# EAGLE board wb_imx233_core_rev_c3 (EAGLE 6.4)
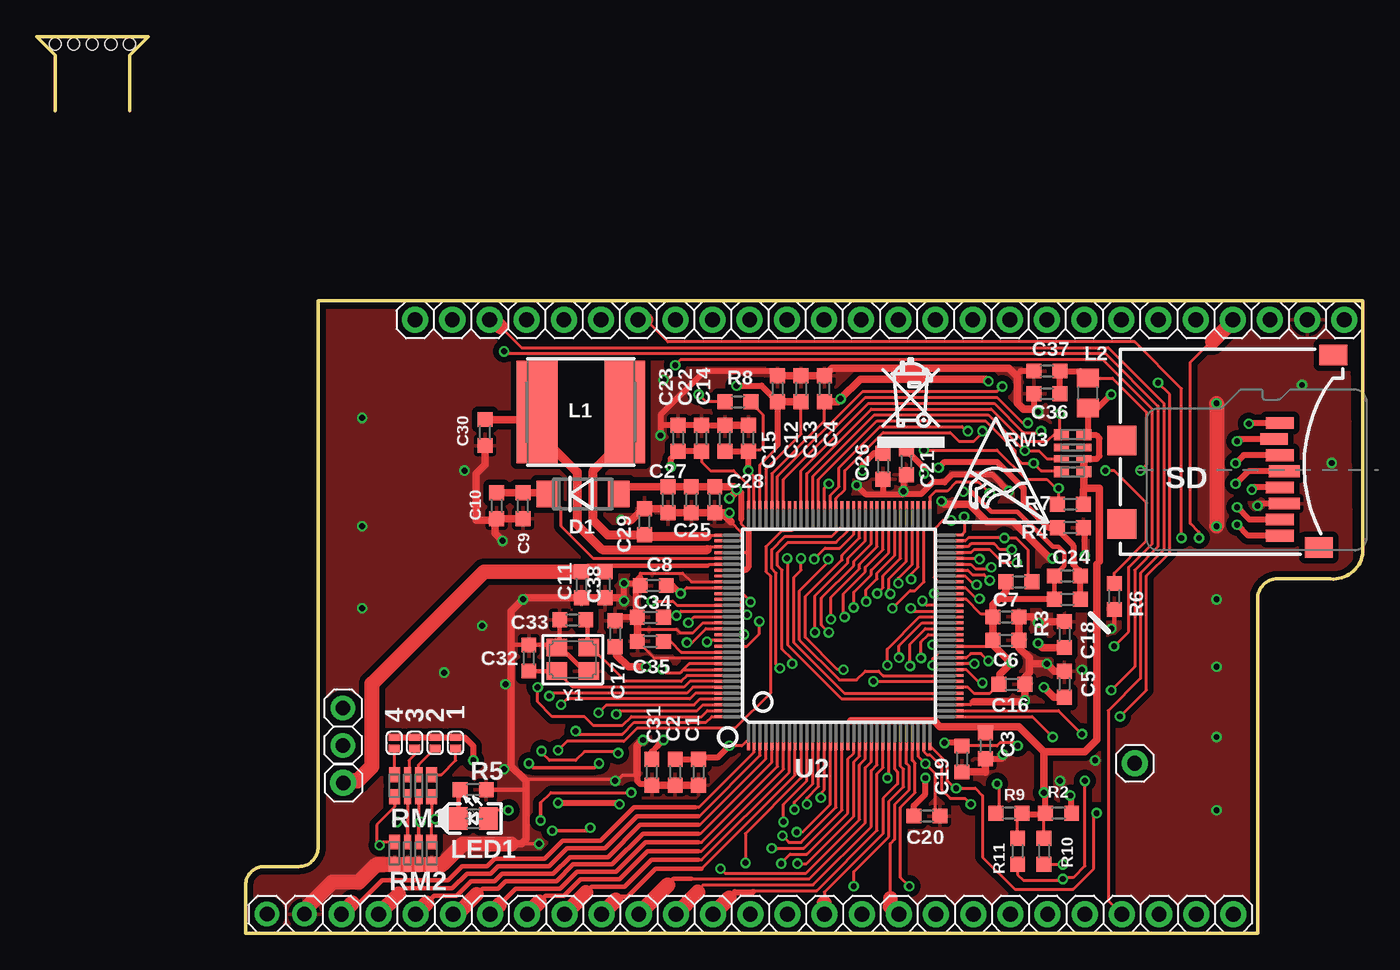
[diagram p2: board, top side]
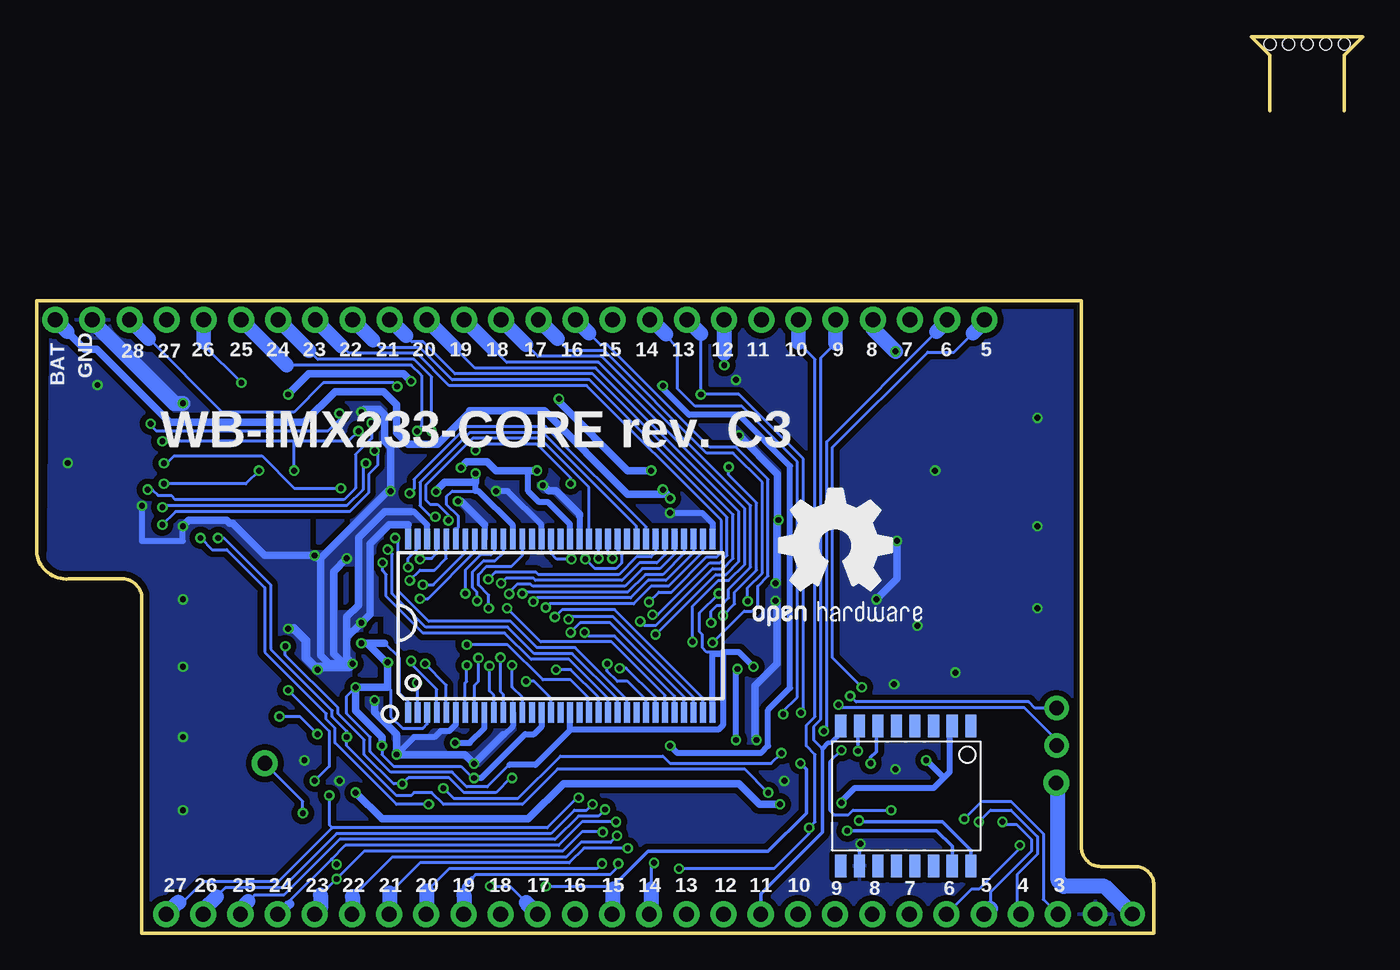
[diagram p3: board, bottom side, seen from below]

Size 90.64 x 61.25 mm. Coordinates in mm from the lower left corner, seen from the top.
Outline: 6.35,56.17 6.35,59.98 7.62,61.25 0,61.25 1.27,59.98 1.27,56.17
Outline: 14.29,0 83.44,0 83.44,23 arc-74 84.64,24.2 88.44,24.2 arc90 90.64,26.06 90.64,43.2 19.24,43.2 19.24,5.87 arc-90 17.92,4.55 15.56,4.55 arc90 14.29,3.28 14.29,0
Copper layers (1*16): Top 0.035mm / dielectric 1.5mm / Bottom 0.035mm
Design rules "SeeedStudio_DRU_no_angle_2layer_Yakov *": minimum track width 6mil, minimum drill 12mil, track to track 0.2mm, track to pad 6mil, pad to pad 6mil, via to via 6mil, smd to smd 0mil, copper to edge 10mil, drill to drill 10mil, minimum pad ring 2mil, minimum via ring 6mil, stop-mask expansion 1mil, vias tented up to drill 25mil, thermal gap 10mil
Net classes: 1 PWR: width 0.203 mm, drill 0.4 mm, clearance 0.076 mm
Holes 0.8 mm at 1.27,60.74 2.54,60.74 3.81,60.74 5.08,60.74 6.35,60.74
tRestrict: 1 lines

## Footprints (pad centres in the part's own frame; a part is rotated, then mirrored left to right if it is on the bottom)
C0603_DWS = smd 1.016 x 1.016: 1 -0.889,0; 2 0.889,0
MLL-41 = smd 1.45 x 1.8: A 2.445,0; K -2.445,0
SJ_1_SMALLER = smd 0.508 x 0.762: 1 -0.381,0; 2 0.381,0
1X02-R = drill 1 pad 1.676: 1 -1.27,0; 2 1.27,0
1X01 = drill 1.016 pad 1.778: 1 0,0
1X25 = drill 1.016 pad 1.778: 1 -29.21,0; 2 -26.67,0; 3 -24.13,0; 4 -21.59,0; 5 -19.05,0; 6 -16.51,0; 7 -13.97,0; 8 -11.43,0; 9 -8.89,0; 10 -6.35,0; 11 -3.81,0; 12 -1.27,0; 13 1.27,0; 14 3.81,0; 15 6.35,0; 16 8.89,0; 17 11.43,0; 18 13.97,0; 19 16.51,0; 20 19.05,0; 21 21.59,0; 22 24.13,0; 23 26.67,0; 24 29.21,0; 25 31.75,0
L7078 = smd 2.8 x 7: 1 -3,0; 2 3,0
L0805_5MIL_DWS = smd 1.27 x 1.524: 1 -1.016,0; 2 1.016,0
LED-0805 = smd 1.27 x 1.524: A 1.016,0; C -1.016,0
R0603_5MIL_DWS = smd 1.016 x 1.016: 1 -0.889,0; 2 0.889,0
R_MATRIX_4 = smd 1.016 x 0.762: 1.1 -0.762,1.27; 1.2 0.762,1.27; 4.1 -0.762,-1.27; 4.2 0.762,-1.27 | smd 1.016 x 0.508: 2.1 -0.762,0.381; 2.2 0.762,0.381; 3.1 -0.762,-0.381; 3.2 0.762,-0.381
TFR/C-MEM-CON = smd 0.8 x 1.9: 1 -3.2,10.9; 2 -2.1,10.5; 3 -1,10.9; 5 1.2,10.9; 7 3.4,10.9; 8 4.5,10.9 | smd 0.8 x 2.1: 4 0.1,11.2; 6 2.3,11.2 | smd 2 x 2: 9 3.7,0.1; 10 -2,0.1 | smd 1.4 x 1.9: 11 5.3,13.55; 12 -7.85,14.55
66TSOP-II = smd 0.4 x 1.4: 1 -10.4,-5.925; 2 -9.75,-5.925; 3 -9.1,-5.925; 4 -8.45,-5.925; 5 -7.8,-5.925; 6 -7.15,-5.925; 7 -6.5,-5.925; 8 -5.85,-5.925; 9 -5.2,-5.925; 10 -4.55,-5.925; 11 -3.9,-5.925; 12 -3.25,-5.925; 13 -2.6,-5.925; 14 -1.95,-5.925; 15 -1.3,-5.925; 16 -0.65,-5.925; 17 0,-5.925; 18 0.65,-5.925; 19 1.3,-5.925; 20 1.95,-5.925; 21 2.6,-5.925; 22 3.25,-5.925; 23 3.9,-5.925; 24 4.55,-5.925; 25 5.2,-5.925; 26 5.85,-5.925; 27 6.5,-5.925; 28 7.15,-5.925; 29 7.8,-5.925; 30 8.45,-5.925; 31 9.1,-5.925; 32 9.75,-5.925; 33 10.4,-5.925; 34 10.4,5.925; 35 9.75,5.925; 36 9.1,5.925; 37 8.45,5.925; 38 7.8,5.925; 39 7.15,5.925; 40 6.5,5.925; 41 5.85,5.925; 42 5.2,5.925; 43 4.55,5.925; 44 3.9,5.925; 45 3.25,5.925; 46 2.6,5.925; 47 1.95,5.925; 48 1.3,5.925; 49 0.65,5.925; 50 0,5.925; 51 -0.65,5.925; 52 -1.3,5.925; 53 -1.95,5.925; 54 -2.6,5.925; 55 -3.25,5.925; 56 -3.9,5.925; 57 -4.55,5.925; 58 -5.2,5.925; 59 -5.85,5.925; 60 -6.5,5.925; 61 -7.15,5.925; 62 -7.8,5.925; 63 -8.45,5.925; 64 -9.1,5.925; 65 -9.75,5.925; 66 -10.4,5.925
TQFP128LD = smd 0.2 x 1.5: 1 -6.2,-7.75; 2 -5.8,-7.75; 3 -5.4,-7.75; 4 -5,-7.75; 5 -4.6,-7.75; 6 -4.2,-7.75; 7 -3.8,-7.75; 8 -3.4,-7.75; 9 -3,-7.75; 10 -2.6,-7.75; 11 -2.2,-7.75; 12 -1.8,-7.75; 13 -1.4,-7.75; 14 -1,-7.75; 15 -0.6,-7.75; 16 -0.2,-7.75; 17 0.2,-7.75; 18 0.6,-7.75; 19 1,-7.75; 20 1.4,-7.75; 21 1.8,-7.75; 22 2.2,-7.75; 23 2.6,-7.75; 24 3,-7.75; 25 3.4,-7.75; 26 3.8,-7.75; 27 4.2,-7.75; 28 4.6,-7.75; 29 5,-7.75; 30 5.4,-7.75; 31 5.8,-7.75; 32 6.2,-7.75; 65 6.2,7.75; 66 5.8,7.75; 67 5.4,7.75; 68 5,7.75; 69 4.6,7.75; 70 4.2,7.75; 71 3.8,7.75; 72 3.4,7.75; 73 3,7.75; 74 2.6,7.75; 75 2.2,7.75; 76 1.8,7.75; 77 1.4,7.75; 78 1,7.75; 79 0.6,7.75; 80 0.2,7.75; 81 -0.2,7.75; 82 -0.6,7.75; 83 -1,7.75; 84 -1.4,7.75; 85 -1.8,7.75; 86 -2.2,7.75; 87 -2.6,7.75; 88 -3,7.75; 89 -3.4,7.75; 90 -3.8,7.75; 91 -4.2,7.75; 92 -4.6,7.75; 93 -5,7.75; 94 -5.4,7.75; 95 -5.8,7.75; 96 -6.2,7.75 | smd 1.5 x 0.2: 33 7.75,-6.2; 34 7.75,-5.8; 35 7.75,-5.4; 36 7.75,-5; 37 7.75,-4.6; 38 7.75,-4.2; 39 7.75,-3.8; 40 7.75,-3.4; 41 7.75,-3; 42 7.75,-2.6; 43 7.75,-2.2; 44 7.75,-1.8; 45 7.75,-1.4; 46 7.75,-1; 47 7.75,-0.6; 48 7.75,-0.2; 49 7.75,0.2; 50 7.75,0.6; 51 7.75,1; 52 7.75,1.4; 53 7.75,1.8; 54 7.75,2.2; 55 7.75,2.6; 56 7.75,3; 57 7.75,3.4; 58 7.75,3.8; 59 7.75,4.2; 60 7.75,4.6; 61 7.75,5; 62 7.75,5.4; 63 7.75,5.8; 64 7.75,6.2; 97 -7.75,6.2; 98 -7.75,5.8; 99 -7.75,5.4; 100 -7.75,5; 101 -7.75,4.6; 102 -7.75,4.2; 103 -7.75,3.8; 104 -7.75,3.4; 105 -7.75,3; 106 -7.75,2.6; 107 -7.75,2.2; 108 -7.75,1.8; 109 -7.75,1.4; 110 -7.75,1; 111 -7.75,0.6; 112 -7.75,0.2; 113 -7.75,-0.2; 114 -7.75,-0.6; 115 -7.75,-1; 116 -7.75,-1.4; 117 -7.75,-1.8; 118 -7.75,-2.2; 119 -7.75,-2.6; 120 -7.75,-3; 121 -7.75,-3.4; 122 -7.75,-3.8; 123 -7.75,-4.2; 124 -7.75,-4.6; 125 -7.75,-5; 126 -7.75,-5.4; 127 -7.75,-5.8; 128 -7.75,-6.2
1 = smd 0.762 x 1.524: 1 -4.445,-4.775; 2 -3.175,-4.775; 3 -1.905,-4.775; 4 -0.635,-4.775; 5 0.635,-4.775; 6 1.905,-4.775; 7 3.175,-4.775; 8 4.445,-4.775; 9 4.445,4.775; 10 3.175,4.775; 11 1.905,4.775; 12 0.635,4.775; 13 -0.635,4.775; 14 -1.905,4.775; 15 -3.175,4.775; 16 -4.445,4.775
CRYSTAL_3.2X2.5 = smd 1.4 x 1.2: 1 -1.1,-0.8; 2 1.1,0.8; GND1 -1.1,0.8; GND2 1.1,-0.8

## Placement (x,y rotation side)
C1  10uF/6.3V  [C0603_DWS]  45.24,11 90 top
C2  22uF/6.3V  [C0603_DWS]  43.64,11 90 top
C3  22uF/6.3V  [C0603_DWS]  64.84,12.8 90 top
C4  22uF/6.3V  [C0603_DWS]  53.84,37.2 270 top
C5  22uF/6.3V  [C0603_DWS]  70.24,17 270 top
C6  100nF  [C0603_DWS]  66.24,20 180 top
C7  100nF  [C0603_DWS]  66.24,21.6 180 top
C8  22uF/6.3V  [C0603_DWS]  42.14,23.75 0 top
C9  22uF/6.3V  [C0603_DWS]  33.24,29.2 90 top
C10  22uF/6.3V  [C0603_DWS]  31.44,29.2 90 top
C11  100nF  [C0603_DWS]  37.24,23.8 90 top
C12  22uF/6.3V  [C0603_DWS]  50.64,37.2 270 top
C13  100nF  [C0603_DWS]  52.24,37.2 270 top
C14  100nF  [C0603_DWS]  47.04,33.8 270 top
C15  22uF/6.3V  [C0603_DWS]  48.64,33.8 270 top
C16  100nF  [C0603_DWS]  66.64,17 180 top
C17  100nF  [C0603_DWS]  39.54,20.45 270 top
C18  100nF  [C0603_DWS]  70.24,20.4 270 top
C19  100nF  [C0603_DWS]  63.24,11.9 90 top
C20  100nF  [C0603_DWS]  60.84,8 180 top
C21  100nF  [C0603_DWS]  59.44,32.2 90 top
C22  22uF/6.3V  [C0603_DWS]  45.44,33.8 270 top
C23  100nF  [C0603_DWS]  43.84,33.8 270 top
C24  100nF  [C0603_DWS]  70.44,24.4 0 top
C25  22uF/6.3V  [C0603_DWS]  44.74,29.6 90 top
C26  100nF  [C0603_DWS]  57.84,31.9 90 top
C27  10uF/6.3V  [C0603_DWS]  43.14,29.6 90 top
C28  10uF/6.3V  [C0603_DWS]  46.34,29.6 90 top
C29  NA(10pF)  [C0603_DWS]  41.54,28.1 270 top
C30  100pF  [C0603_DWS]  30.64,34.2 90 top
C31  100nF  [C0603_DWS]  42.04,11 90 top
C32  15pF  [C0603_DWS]  33.64,18.8 270 top
C33  15pF  [C0603_DWS]  36.64,21.4 0 top
C34  100nF  [C0603_DWS]  41.94,21.58 0 top
C35  1uF  [C0603_DWS]  41.94,19.93 0 top
C36  22uF/6.3V  [C0603_DWS]  69.04,36.85 0 top
C37  22uF/6.3V  [C0603_DWS]  69.04,38.4 0 top
C38  22uF/6.3V  [C0603_DWS]  38.84,23.8 90 top
D1  PMEG4030EP  [MLL-41]  37.34,30 0 top
D01_  Open  [SJ_1_SMALLER]  27.24,13 90 top
D2  Close  [SJ_1_SMALLER]  24.44,13 90 top
D3  Open  [SJ_1_SMALLER]  25.84,13 90 top
D4  Close  [SJ_1_SMALLER]  28.64,13 90 top
JP1  [1X02-R]  20.94,14.1 270 top
JP2  [1X01]  25.87,41.91 0 top
JP3  [1X25]  50.04,1.3 0 top
JP4  [1X25]  57.62,41.91 0 top
JP5  [1X01]  75.04,11.6 0 top
JP6  [1X02-R]  17.02,1.3 0 top
JP7  [1X01]  20.96,10.26 0 top
L1  22uH/1.5A/YS75/7x8mm  [L7078]  37.2,35.6 0 top
L2  CL470nH/0805/1.76R/250mA  [L0805_5MIL_DWS]  71.84,36.9 90 top
LED1  GREEN  [LED-0805]  29.84,7.83 0 top
R1  10k  [R0603_5MIL_DWS]  67.14,24 180 top
R2  47k  [R0603_5MIL_DWS]  69.84,8.2 0 top
R3  1k/1%  [R0603_5MIL_DWS]  70.44,22.8 180 top
R4  1k/1%  [R0603_5MIL_DWS]  70.64,27.7 180 top
R5  2.2k  [R0603_5MIL_DWS]  29.84,9.81 180 top
R6  1M  [R0603_5MIL_DWS]  73.64,23 270 top
R7  10k  [R0603_5MIL_DWS]  70.64,29.3 0 top
R8  4.7k  [R0603_5MIL_DWS]  47.94,36.3 180 top
R9  47k  [R0603_5MIL_DWS]  66.44,8.2 0 top
R10  2.2k  [R0603_5MIL_DWS]  68.84,5.6 90 top
R11  2.2k  [R0603_5MIL_DWS]  67.04,5.6 90 top
RM1  3k3 CAY16-332J4LF  [R_MATRIX_4]  25.74,10.07 270 top
RM2  22k CRA06S08322K0FKTR  [R_MATRIX_4]  25.74,5.46 270 top
RM3  RA1206_(4X0603)_4B8_100K  [R_MATRIX_4]  70.81,32.79 0 top
SD  MICRO_SD/MMC_NEW  [TFR/C-MEM-CON]  74.07,31.65 270 top
U1  HY5DU121622D(L)T(P)-J  [66TSOP-II]  54.84,21 0 bottom
U2  MCIMX233CAG4C  [TQFP128LD]  54.84,21 0 top
U$1  S25FL512S  [1]  31.24,9.37 180 bottom
U$5  [LOGO-OPENHARDWARE_8X8]  36.07,26.4 0 bottom
U$10  [ESD_SYMBOL]  61.99,28.06 0 top
U$11  [RECYCLE_BIN1/8]  57.46,33.15 0 top
Y1  Q24.000MHz  [CRYSTAL_3.2X2.5]  36.64,18.7 0 top

## Tracks (layer width: path | path; a pad name or v marks a point on that pad's centre or on a via)
+5V
  Top 0.2: 45.84,25.1 45.94,25.2 U2.102
  Top 0.254: C38.2 38.84,25.1
  Top 0.305: 45.84,25.1 38.84,25.1 37.66,25.1 C11.2
  Top 0.406: 37.33,24.69 C11.2
  Top 1: C11.2 30.57,24.69 22.92,17.04
  Top 1.016: 22.92,17.04 22.92,11.4 21.92,10.4 21.1,10.4 JP7.1
  Bottom 1.016: JP6.1 17.64,3.2 20.44,3.2 20.84,3.6 20.84,10.14 JP7.1
+24V  (via drill 0.4)
  Top 0.2: 48.64,26 U2.100 | 48.14,28.3 48.14,27.98 48.64,27.48 | 48.44,24.8 U2.103
  Top 0.4: 47.95,30.29 48.14,30.1 48.14,28.3 | 48.44,24.8 48.64,25 48.64,26 48.64,27.48
  Top 0.5: v47.84,30.3 47.66,30.49 C28.2 C25.2 C27.2 39.79,30.49 D1.A | v47.84,30.3 47.84,30.2 v47.34,29.7 | 47.95,30.29 v47.86,30.29 v47.84,30.3
  Bottom 0.4: v47.34,29.7 47.94,30.3 47.79,30.3
  Bottom 0.5: 88.56,41.1 87.36,39.9 86.54,39.9 81.54,34.9 72.34,34.9 70.24,37 66.94,37 66.04,36.1 66.04,34.2 65.24,33.4 63.24,33.4 61.04,35.6 61.04,35.7 55.94,35.7 50.24,30 47.54,30 v47.84,30.3
  Bottom 1: 88.56,41.1 JP4.25
A0  (via drill 0.4)
  Top 0.2: U2.76 56.64,26.8 55.44,25.6 55.44,25.3 53.19,23.05 v53.19,20.55
  Bottom 0.2: U1.29 47.04,16.2 51.14,20.3 52.94,20.3 v53.19,20.55
A1  (via drill 0.4)
  Top 0.2: U2.75 57.04,26.6 55.84,25.4 55.84,25.1 53.64,22.9 53.64,21.05 v54.14,20.55
  Bottom 0.2: U1.30 46.39,16.15 51.44,21.2 53.49,21.2 v54.14,20.55
A2  (via drill 0.4)
  Top 0.2: U2.74 57.44,26.4 56.24,25.2 56.24,24.9 54.29,22.95 v54.29,21.45
  Bottom 0.2: U1.31 45.74,16.1 51.24,21.6 54.14,21.6 v54.29,21.45
A3  (via drill 0.4)
  Top 0.2: U2.73 57.84,26.2 56.64,25 56.64,24.7 55.14,23.2 55.14,21.68 v55.22,21.6
  Bottom 0.2: U1.32 45.09,16.05 51.14,22.1 54.72,22.1 v55.22,21.6
A4  (via drill 0.4)
  Top 0.2: v55.84,22.25 55.84,23.3 57.04,24.5 57.04,24.8 58.24,26 U2.72
  Bottom 0.2: v55.84,22.25 55.59,22.5 49.84,22.5 48.64,23.7 47.44,23.7 45.09,26.05 U1.35
A5  (via drill 0.4)
  Top 0.2: v56.69,22.65 56.69,23.45 57.44,24.2 57.44,24.6 58.64,25.8 U2.71
  Bottom 0.2: v56.69,22.65 56.44,22.9 50.04,22.9 48.84,24.1 47.64,24.1 45.74,26 U1.36
A6  (via drill 0.4)
  Top 0.2: v57.44,23.2 57.84,23.6 57.84,24.4 59.04,25.6 U2.70
  Bottom 0.2: v57.44,23.2 57.34,23.3 50.24,23.3 49.04,24.5 47.84,24.5 46.39,25.95 U1.37
A7  (via drill 0.4)
  Top 0.2: v58.34,23.18 58.34,23.3 58.24,23.4 58.24,24.2 59.44,25.4 U2.69
  Bottom 0.2: v58.34,23.18 58.34,23.3 57.79,23.85 56.89,23.85 56.74,23.7 50.44,23.7 49.24,24.9 48.04,24.9 47.04,25.9 U1.38
A8  (via drill 0.4)
  Top 0.2: v58.89,23.9 58.89,24.25 59.84,25.2 U2.68
  Bottom 0.2: v58.89,23.9 58.54,24.25 56.69,24.25 56.54,24.1 50.64,24.1 49.44,25.3 48.24,25.3 47.69,25.85 U1.39
A9  (via drill 0.4)
  Top 0.2: v59.77,24.18 59.77,24.53 60.24,25 U2.67
  Bottom 0.2: v59.77,24.18 59.29,24.65 56.49,24.65 56.34,24.5 50.84,24.5 49.64,25.7 48.64,25.7 48.34,26 U1.40
A10  (via drill 0.4)
  Top 0.2: U2.66 60.64,24 60.04,23.4 59.69,23.4 v58.49,22.2
  Bottom 0.2: U1.28 47.69,16.25 51.34,19.9 56.19,19.9 v58.49,22.2
A11  (via drill 0.4)
  Top 0.2: v65.14,30.05 64.39,30.8 62.84,30.8 62.24,30.2 61.44,30.2 61.04,29.8 U2.65
  Bottom 0.2: U1.41 48.99,27.75 55.84,34.6 61.24,34.6 64.84,31 64.84,30.35 v65.14,30.05
A12  (via drill 0.4)
  Top 0.2: U2.64 63.19,27.2 63.39,27.4 v63.39,28.45
  Bottom 0.2: U1.42 49.64,27.8 56.04,34.2 61.04,34.2 64.44,30.8 64.44,29.2 63.69,28.45 v63.39,28.45
AUART1_RXD  (via drill 0.4)
  Top 0.2: U2.128 46.14,14.8 45.74,14.4 40.84,14.4 40.04,13.6 37.04,13.6 v36.84,13.8
  Bottom 0.2: 29.13,41.09 36.64,33.58 36.64,14 v36.84,13.8
  Bottom 1: JP4.1 28.41,41.81 29.13,41.09
AUART1_TXD  (via drill 0.4)
  Top 0.2: U2.127 45.84,15.2 45.44,14.8 40.64,14.8 40.04,14.2 38.04,14.2 37.44,14.8 35.24,14.8 34.24,15.8 v34.24,16.8
  Bottom 0.2: 25.87,41.77 26.64,41 27.94,39.7 29.74,39.7 36.24,33.2 36.24,18.8 v34.24,16.8 | 25.84,41.9 JP2.1
  Bottom 1: 25.84,41.9 25.84,41.8 26.64,41
BA0  (via drill 0.4)
  Top 0.2: U2.79 55.44,27.5 54.64,26.7 51.34,26.7 50.64,26 50.64,25.1 50.94,24.8 50.94,19.4 51.64,18.7 v51.64,18.4
  Bottom 0.2: U1.26 48.99,15.95 50.24,17.2 50.94,17.2 51.64,17.9 v51.64,18.4
BA1  (via drill 0.4)
  Top 0.2: U2.80 55.04,27.8 54.34,27.1 51.14,27.1 50.24,26.2 50.24,24.9 50.54,24.6 50.54,18.35 v50.79,18.1
  Bottom 0.2: U1.27 48.34,16.1 50.34,18.1 v50.79,18.1
CASN  (via drill 0.4)
  Top 0.2: U2.61 63.87,26 64.07,26.2 65.14,26.2 66.04,25.3 v66.99,25.3
  Bottom 0.2: U1.22 51.59,16.05 54.24,18.7 56.84,18.7 58.64,20.5 64.24,20.5 66.74,23 66.74,24.5 66.99,24.75 v66.99,25.3
CKE  (via drill 0.4)
  Top 0.2: v53.14,25.55 53.89,26.3 54.89,26.3 55.84,27.25 U2.78
  Bottom 0.2: v53.14,25.55 52.49,24.9 51.04,24.9 50.64,25.3 50.64,25.93 50.94,26.23 U1.44
CLK  (via drill 0.4)
  Top 0.2: 62.64,16 U2.36 55.02,16 51.34,19.68 51.34,25.55 v51.29,25.6
  Bottom 0.2: U1.45 51.59,25.9 v51.29,25.6
CLKN  (via drill 0.4)
  Top 0.2: v52.24,25.6 52.24,24.8 51.74,24.3 51.74,19.85 55.19,16.4 U2.37
  Bottom 0.2: v52.24,25.6 U1.46
CS  (via drill 0.4)
  Top 0.2: U2.63 63.47,26.8 63.67,27 v66.14,27 66.94,27 67.74,26.2 67.74,24.29 R1.1
  Bottom 0.2: U1.24 50.29,15.95 53.84,19.5 56.44,19.5 58.24,21.3 63.84,21.3 65.94,23.4 65.94,26.8 v66.14,27
CS_MEMORY  (via drill 0.4)
  Top 0.2: v39.74,12.3 39.64,12.4 37.44,12.4 36.84,11.8 35.04,11.8 34.56,12.29 34.56,12.3 34.54,12.3 34.51,12.33 v34.51,12.45 | U2.32 61.04,12.8 62.24,11.6 62.24,10.4 62.74,9.9 v62.84,9.9 64.14,9.9 64.64,9.4 64.64,5.2 66.84,3 70.84,3 72.24,4.4 72.24,8 v72.44,8.2
  Bottom 0.2: v62.84,9.9 62.14,9.2 57.74,9.2 54.84,12.1 47.84,12.1 47.34,11.6 40.44,11.6 v39.74,12.3 | v72.44,8.2 72.44,9 JP5.1
  Bottom 0.254: v34.51,12.45 34.51,14.06 U$1.7
CS_UEXT_GPIO  (via drill 0.4)
  Top 0.2: v58.14,10.6 58.14,10.7 58.24,10.8 U2.25 | v73.64,19.6 74.64,20.6 74.64,25 76.24,26.6 76.24,35.8 72.84,39.2 44.04,39.2 v43.64,38.8 | v65.64,10.2 65.75,10.09 65.75,8.6
  Top 0.254: 65.75,8.6 65.56,8.6 R9.1
  Bottom 0.2: v58.14,10.6 58.24,10.6 59.24,9.6 61.44,9.6 62.44,10.6 65.24,10.6 v65.64,10.2 66.24,10.2 68.24,12.2 68.24,13.2 70.04,15 70.04,15.4 73.64,19 v73.64,19.6 | v43.64,38.8 43.64,39.6
  Bottom 1.016: 43.64,39.6 JP4.7
D0  (via drill 0.4)
  Top 0.2: U2.41 63.54,18 64.44,17.1 v64.64,17.1
  Bottom 0.2: U1.2 64.59,17.05 v64.64,17.1
D1  (via drill 0.4)
  Top 0.2: U2.43 63.54,18.8 63.84,19.1 64.54,19.1 v65.04,18.6
  Bottom 0.2: v65.04,18.6 65.04,18.4 63.29,16.65 U1.4
D2  (via drill 0.4)
  Top 0.2: v64.09,18.4 U2.42
  Bottom 0.2: v64.09,18.4 62.64,16.95 U1.5
D3  (via drill 0.4)
  Top 0.2: v61.24,18.3 61.24,18.75 61.69,19.2 U2.44
  Bottom 0.2: v61.24,18.3 61.24,17.2 61.34,17.1 U1.7
D4  (via drill 0.4)
  Top 0.2: U2.47 60.94,20.4 60.44,19.9 v60.44,18.8
  Bottom 0.2: v60.44,18.8 60.44,17.2 60.69,16.95 U1.8
D5  (via drill 0.4)
  Top 0.2: v59.69,18.25 59.69,19.75 60.74,20.8 U2.48
  Bottom 0.2: U1.10 59.39,16.25 59.69,16.55 v59.69,18.25
D6  (via drill 0.4)
  Top 0.2: U2.49 60.52,21.2 58.94,19.62 v58.94,18.82
  Bottom 0.2: U1.11 58.74,16.3 58.94,16.5 v58.94,18.82
D7  (via drill 0.4)
  Top 0.2: U2.50 60.34,21.6 58.14,19.4 v58.14,18.3
  Bottom 0.2: U1.13 57.44,16.1 58.14,16.8 v58.14,18.3
D8  (via drill 0.4)
  Top 0.2: U2.51 59.94,22 v59.74,22.2
  Bottom 0.2: U1.54 57.44,25.8 58.19,25.05 59.89,25.05 60.44,24.5 60.44,23.8 59.74,23.1 v59.74,22.2
D9  (via drill 0.4)
  Top 0.2: U2.52 60.84,22.4 v60.54,22.7
  Bottom 0.2: v60.54,22.7 60.54,23.3 60.84,23.6 60.84,24.7 60.09,25.45 59.29,25.45 58.74,26 U1.56
D10  (via drill 0.4)
  Top 0.2: v61.34,23.2 U2.54
  Bottom 0.2: U1.57 59.39,26.05 59.59,25.85 60.29,25.85 61.34,24.8 v61.34,23.2
D11  (via drill 0.4)
  Top 0.2: v64.44,22.85 64.22,22.85 63.47,23.6 U2.55
  Bottom 0.2: U1.59 60.69,26.05 63.89,22.85 v64.44,22.85
D12  (via drill 0.4)
  Top 0.2: U2.57 63.44,24.4 64.04,23.8 v64.24,23.8
  Bottom 0.2: U1.60 61.34,26 63.54,23.8 v64.24,23.8
D13  (via drill 0.4)
  Top 0.2: U2.58 63.64,24.8 63.94,24.5 64.74,24.5 v65.14,24.1
  Bottom 0.2: v65.14,24.1 64.44,24.8 63.44,24.8 62.64,25.6 U1.62
D14  (via drill 0.4)
  Top 0.2: U2.60 64.39,25.6 v64.44,25.55
  Bottom 0.2: v64.44,25.55 64.39,25.6 63.64,25.6 63.29,25.95 U1.63
D15  (via drill 0.4)
  Top 0.2: U2.59 63.84,25.2 64.14,24.9 65.14,24.9 v65.24,25
  Bottom 0.2: v65.24,25 65.24,25.62 64.59,26.28 U1.65
DCDC_VDDA  (via drill 0.4)
  Top 0.2: U2.110 44.03,22 v43.73,21.7 42.94,21.7 42.94,21.58 C34.2 | C22.2 45.44,32.2 46.04,31.6 47.64,31.6 48.64,30.6 U2.96
  Top 0.4: v43.34,31.85 43.34,32.41 C23.2 C22.2
  Bottom 0.2: v43.73,21.7 42.94,22.49 42.94,23.3 41.44,24.8 41.44,29.4 43.34,31.3 v43.34,31.85
DCDC_VDDD  (via drill 0.4)
  Top 0.2: U2.93 49.84,31.7 52.24,34.1 C13.2 | U2.94 49.44,32 50.64,33.2 50.64,33.4 | U2.1 48.19,12.8 v47.34,12.8
  Top 0.4: v47.84,37.4 49.55,37.4 C12.2 50.64,33.4 | 46.53,11.99 v47.34,12.8
  Top 0.406: C2.2 C1.2 45.34,11.99 46.53,11.99
  Top 0.5: C12.2 C13.2
  Bottom 0.4: v47.34,12.8 46.84,12.3 41.14,12.3 40.64,12.8 40.64,15.26 39.14,16.76 39.14,31.9 42.64,35.4 46.04,35.4 48.04,37.4 v47.84,37.4
DQM0  (via drill 0.4)
  Top 0.2: U2.46 61.54,20 v61.24,19.7
  Bottom 0.2: U1.20 52.94,15.12 52.94,16.1 54.14,17.3 56.04,17.3 58.44,19.7 v61.24,19.7
DQM1  (via drill 0.4)
  Top 0.2: U2.56 61.64,24 61.34,24.3 61.34,27.6 61.94,28.2 v62.49,28.2
  Bottom 0.2: U1.47 52.89,30.45 56.24,33.8 60.84,33.8 64.04,30.6 64.04,29.6 63.74,29.3 63.24,29.3 62.49,28.55 v62.49,28.2
DQS0  (via drill 0.4)
  Top 0.2: v57.19,17.2 U2.39
  Bottom 0.2: U1.16 55.49,16.05 56.64,17.2 v57.19,17.2
DQS1  (via drill 0.4)
  Top 0.2: U2.40 57.84,17.6 57.54,17.9 56.64,17.9 56.04,17.3 54.87,17.3 52.14,20.03 52.14,23.4 54.09,25.35 v54.09,25.55
  Bottom 0.2: v54.09,25.55 55.09,25.55 55.49,25.95 U1.51
GND  (via drill 0.4)
  Top 0.2: U2.118 42.18,18.8 C35.1 | 41.09,20.75 43.74,20.75 43.97,20.53 44.87,20.53 45.54,21.2 U2.112 | U2.105 44.74,24 44.14,24.6 41.24,24.6 41.24,24.3 | U2.98 48.04,26.8 48.14,26.9 48.14,27.4 47.42,28.12 | 64.04,15.8 63.84,15.6 U2.35 | C20.1 61.64,8 61.44,8.2 61.44,10.88 v60.74,11.57 60.24,12.07 U2.30 | 35.36,19.69 Y1.GND1 | 37.54,17.9 Y1.GND2 37.72,17.92 37.72,18 37.34,18 | 36.24,19.1 35.94,19.1 Y1.GND1 | v32.04,17 32.44,16.6 | 35.76,19.71 Y1.GND1
  Top 0.254: v34.34,6.1 32.44,6.1 | 33.34,10.5 39.74,10.5 40.04,10.8 41.04,10.8
  Top 0.3: 37.34,18 36.24,19.1 | R6.2 73.64,21 v73.44,20.8 | R5.1 33.25,9.81 33.44,10 | C33.1 35.76,19.71 | 35.36,19.69 C32.1 32.84,19.69 32.55,19.69 32.44,19.8
  Top 0.4: v56.04,30.6 56.64,30 57.84,30 | 59.24,30 60.44,30 61.24,30.8 62.04,30.8 62.54,31.3 65.34,31.3 v66.44,30.2 | 57.84,30 59.24,30 | 59.24,30 v59.24,30.2 59.24,31.2 59.36,31.31 C21.1 | C12.1 50.55,38.09 50.24,38.4 45.64,38.4 42.64,35.4 42.64,34.8 | C14.1 C22.1 42.76,34.69 42.64,34.8 | 41.26,23.71 40.94,23.4 | 42.64,34.8 v42.64,34 | C26.1 57.84,30 | C36.1 68.16,35.89 v68.44,35.6 | C37.1 67.24,38.4 66.94,38.1 | v71.64,25.8 71.64,27.59 R4.1
  Top 0.406: SD.6 83.59,29.35 v83.44,29.2 | 40.94,23.4 40.94,21.69 | 39.78,21.54 39.58,21.34 C17.1 | v40.14,22.7 v40.14,23.9 41.11,23.9 | 41.11,23.9 C8.1 | 41.11,23.9 41.11,24.16 41.24,24.3 | 41.09,20.75 41.04,20.8 41.04,21.6 39.65,21.6 39.64,21.6 | C3.1 65.95,11.91 66.04,12 | 41.04,10.8 41.04,10.4 41.24,10.2 41.95,10.2 C31.1
  Top 0.5: 41.09,19.88 41.09,19.89 C35.1 C34.1 | 47.44,28.1 47.42,28.12 46.86,28.69 46.86,28.71 C28.1 v47.36,28.71 C25.1 C27.1 42.86,29 C29.1 | 67.44,15.8 67.53,15.8 C16.1 67.53,17.49 67.84,17.8 67.84,18.8 67.13,19.51 C6.1 67.13,21.49 67.24,21.6 | 67.44,15.8 64.04,15.8 | C1.1 C2.1 C31.1 | v61.84,29.5 62.04,29.3 63.74,29.3 64.94,28.1 66.74,28.1 69.24,25.6 v69.44,25.6 | 41.26,23.71 C8.1 | v41.44,13.2 41.04,12.8 41.04,10.8 | C7.1 67.13,21.7 | C29.1 | 32.44,6.1 33.14,6.1 33.44,6.4 33.44,10 33.44,10.4 33.34,10.5 32.44,11.4 32.44,16.6 32.44,19.8 32.44,22 v33.24,22.8 33.36,22.91 C38.1 | C12.1 C13.1 C4.1 54.36,38.6 66.44,38.6 66.94,38.1 67.04,38 67.04,36.2 67.44,35.8 68.24,35.8 v68.44,35.6 | C15.1 C14.1 | C9.1 C10.1 31.33,28.2 | 66.04,12 v66.04,12.2 | v69.04,18.4 68.04,18.4 | v67.54,15.9 67.44,15.8 | 69.16,18.29 v69.04,18.4 | C5.1 69.56,17.89 v69.04,18.4 | C19.1 64.83,11.01 64.84,11 C3.1 | C18.1 68.53,21.29 v68.44,21.2 68.04,21.6 67.24,21.6 | C7.1 67.24,21.6 | C7.1 67.04,21.6 | C29.1 41.44,29 40.64,28.2 39.97,28.2 v39.94,28.23 | C11.1 C38.1 | C38.1 39.93,22.91 v40.14,22.7 | C30.1 30.64,32 30.04,31.4 30.04,28.2 31.33,28.2 | 31.33,28.2 31.33,27.31 v31.84,26.8
  Top 1.016: 32.44,6.1 29.14,6.1 27.74,4.7 23.24,4.7 22.04,3.5 20.22,3.5 18.35,1.63 18.35,1.36 JP6.2 | v80.64,36.2 v80.64,27.8
  Bottom 0.254: U$1.10 34.42,6.02 v34.34,6.1
  Bottom 0.4: 53.54,28.5 U1.48 | 65.04,28.8 64.84,28.8 63.94,27.9 U1.64 | 65.24,27.9 U1.66 | 60.04,27.9 U1.58 | U1.52 56.14,27.9 58.44,30.2 v59.24,30.2 | U1.12 58.09,14.15 58.69,13.55 58.77,13.55 | U1.6 61.99,14.25 62.44,13.8 63.04,13.8 63.44,13.4 64.84,13.4 v66.04,12.2
  Bottom 0.406: v47.36,28.71 45.16,28.71 44.44,28 U1.34 | v80.64,27.8 80.64,26.8 83.44,26.8 v83.44,29.2
  Bottom 0.5: 53.54,28.5 53.54,28.61 55.14,30.21 55.66,30.21 v56.04,30.6 | 65.04,28.8 66.84,28.8 68.64,27 68.64,22.4 69.44,21.6 69.44,20.2 | 65.24,27.9 66.54,27.9 67.84,26.6 67.84,21.8 v68.44,21.2 69.44,20.2 | v61.84,29.5 61.64,29.5 60.04,27.9 | v41.44,13.2 41.54,13.3 41.54,16.9 40.04,18.4 40.04,22.6 v40.14,22.7 | 71.24,25.6 66.64,30.2 v66.44,30.2 66.44,33.2 66.84,33.6 66.84,35.4 67.24,35.8 68.24,35.8 v68.44,35.6 | 71.24,25.6 71.24,19 70.64,18.4 69.64,18.4 | v40.14,23.9 40.04,24 40.04,28.12 v39.94,28.23 39.99,28.23 39.99,31.35 v42.64,34 | v67.54,15.9 67.54,15.1 66.04,13.6 v66.04,12.2 61.37,12.2 v60.74,11.57 58.77,13.55 | 69.44,20.2 69.44,18.8 v69.04,18.4 | 69.64,18.4 70.34,19.1 70.34,24.7 v69.44,25.6 | 69.64,18.4 v69.04,18.4 | v31.84,26.8 31.84,24.2 v33.24,22.8 | 69.14,18.3 v69.04,18.4 | v80.64,27.8 80.24,28.2 77.64,28.2 77.44,28 77.24,28 75.04,25.8 v71.64,25.8 71.44,25.6 71.24,25.6
  Bottom 0.61: v73.44,20.8 73.04,20.8 72.24,20 72.24,18.8 71.64,18.2 69.24,18.2 v69.04,18.4
  Bottom 1.016: JP4.24 86.83,41.79 81.24,36.2 v80.64,36.2
  other vias: 31.94,11.2 72.34,11.8 69.94,10.4 86.49,37.45 88.52,32.12 71.44,18 39.54,10.4 42.84,37.8 30.44,21 27.84,17.8 22.24,22.2 22.24,27.8 22.24,35.2 29.24,31.6 80.64,22.8 80.64,18.2 80.64,13.4 80.64,8.4
  pour Top (isolate 0.4, rank 2): 14.24,42.56 14.24,0.56 90.12,0.56 89.64,42.56
  pour Bottom (isolate 0.4, rank 3): 14.24,0.56 90.12,0.56 89.64,42.56 14.24,42.56
HP_VGND  (via drill 0.4)
  Top 0.2: v44.54,21.2 44.94,21.6 U2.111
  Bottom 0.2: v44.54,21.2 44.54,22 44.14,22.4 43.84,22.4 43.34,22.9 43.34,23.5 41.84,25 41.84,29.2 52.04,39.4 56.38,39.4 57.18,40.2
  Bottom 1: 57.18,40.2 JP4.13
HPL  (via drill 0.4)
  Top 0.2: v44.44,19.85 44.79,19.85 45.74,20.8 U2.113
  Bottom 0.2: v44.44,19.85 42.29,22 41.74,22 41.34,22.4 41.34,23.7 40.64,24.4 40.64,31 42.84,33.2 44.64,33.2 51.64,40.2 52.1,40.2 52.9,41
  Bottom 1: 52.9,41 JP4.11
HPR  (via drill 0.4)
  Top 0.2: v42.04,22.68 43.49,22.68 43.77,22.4 U2.109
  Bottom 0.2: v42.04,22.68 42.04,23.6 41.04,24.6 41.04,30.8 43.04,32.8 44.84,32.8 51.84,39.8 54.24,39.8 55.04,40.6
  Bottom 1: 55.04,40.6 JP4.12
I2C_SCL  (via drill 0.4)
  Top 0.2: 31.74,41.4 33.14,40 73.24,40 77.04,36.2 77.04,26.2 75.44,24.6 75.44,17.4 73.24,15.2 73.24,2.2 74.04,1.4 74.04,1.36 | U2.11 52.64,10.4 51.04,8.8 v51.04,7.6 | R10.1 v70.13,4.71 v70.14,4.7
  Top 1: JP4.2 31.23,41.91 31.74,41.4
  Top 1.016: 74.04,1.36 74.11,1.36 JP3.22
  Bottom 0.2: v51.04,7.6 53.37,7.6 54.97,6 69.54,6 70.49,5.05 | 73.34,2 73.34,2.2 70.49,5.05 | v70.14,4.7 70.49,5.05
  Bottom 0.61: 74.07,1.27 73.34,2
  Bottom 1.016: 74.07,1.27 74.14,1.27 JP3.22
I2C_SDA  (via drill 0.4)
  Top 0.2: v73.44,16.6 75.04,18.2 75.04,24.8 76.64,26.4 76.64,36 73.04,39.6 32.09,39.6 v31.95,39.74 | U2.15 54.24,8.8 52.34,6.9 v51.94,6.9 | v71.64,10.4 71.64,4.6 70.84,3.8 70.24,3.8 v70.14,3.7 70.04,3.6 67.44,3.6 67.04,4 R11.1
  Bottom 0.2: v73.44,16.6 70.64,13.8 70.64,11.4 v71.64,10.4 | v51.94,6.9 51.99,6.95 53.34,6.95 54.69,5.6 68.24,5.6 v70.14,3.7 71.24,2.6
  Bottom 1.016: JP4.3 33.49,41.29 v31.95,39.74 | 71.24,2.6 71.24,1.69 JP3.21
LED  (via drill 0.4)
  Top 0.2: U2.88 51.84,27.7 51.64,27.5 50.94,27.5 49.84,26.4 49.84,24.7 50.14,24.4 50.14,16.4 47.74,14 41.04,14 40.14,13.1 36.24,13.1 v35.64,12.5 | v32.24,8.4 31.43,8.4 LED1.A
  Bottom 0.2: v35.64,12.5 36.44,11.7 36.44,8.4 36.14,8.1 35.14,8.1 34.84,8.4 v32.24,8.4
LIN1_INL  (via drill 0.4)
  Top 0.2: U2.115 45.92,20 v45.82,19.9
  Bottom 0.2: v45.82,19.9 45.82,22.33 44.04,24.1 43.34,24.1 42.24,25.2 42.24,29 52.24,39 58.52,39 59.42,39.9
  Bottom 1: 59.42,39.9 JP4.14
LIN1_INR  (via drill 0.4)
  Top 0.2: U2.114 v48.34,20.4
  Bottom 0.2: v48.34,20.4 44.24,24.5 43.54,24.5 42.64,25.4 42.64,28.8 52.44,38.6 60.66,38.6 62.06,40
  Bottom 1: 62.06,40 JP4.15
N$1
  Top 0.2: D2.1 24.44,10.85 RM1.4.1
N$3
  Top 0.2: D3.1 25.84,12.2 25.44,11.8 25.44,10.92 RM1.3.1
N$4
  Top 0.2: RM1.2.1 26.12,11.49 D01_.1
N$5
  Top 0.2: RM1.1.1 27.68,10.83 28.64,11.8 D4.1
N$7  (via drill 0.4)
  Top 0.4: v61.64,31.8 62.04,32.2 65.64,32.2 67.44,30.4 | 67.44,30.2 67.44,29.4 69.14,27.7 R4.2 69.75,27.59 70.84,26.5 70.84,25.2 71.24,24.8 71.24,24.49 C24.2
  Top 0.406: 67.44,30.4 67.44,30.2 | R3.1 C24.2 | C26.2 57.23,32.79 56.44,32 v56.44,31.6
  Bottom 0.4: U1.49 54.19,27.95 55.69,29.45 56.29,29.45 57.04,30.2 57.04,31.6
  Bottom 0.5: v61.64,31.8 61.24,32.2 59.84,32.2 59.24,31.6 57.04,31.6 v56.44,31.6
N$8
  pour Bottom (isolate 0.406): 71.44,18.6 71.44,28.8 68.54,28.9 64.94,28.9 64.94,27.1 66.34,27.1 67.44,26 67.44,17.6 70.44,17.6
N$18
  Top 0.2: 45.84,27.1 45.94,27.2 U2.97
  Top 0.5: 39.64,33.2 40.2,33.2 L1.2
  Top 0.6: 39.64,33.2 38.04,31.6 38.04,28.2 39.04,27.2 C29.2 | C29.2 | C29.2 41.66,27.1 45.84,27.1
N$19
  Top 0.2: 46.04,26.4 U2.99
  Top 0.203: 45.84,26.2 46.04,26.4
  Top 0.4: 33.64,35.15 33.64,35.2
  Top 0.5: 34.24,34.2 34.2,34.2 L1.1 34.2,35.2 33.64,35.2 | C30.2 33.36,35.09 34.34,34.1
  Top 0.6: 45.84,26.2 38.64,26.2 36.94,27.9 36.94,31.5 34.34,34.1 34.24,34.2 | 34.24,35.65 L1.1
N$25
  Top 0.2: C35.2 43.32,19.93 44.04,19.2 U2.117
N$42
  Top 0.3: LED1.C 28.83,9.68 R5.2
PIN1/LCD_D00  (via drill 0.4)
  Top 0.2: U2.2 49.04,12.38 45.27,8.6 45.04,8.6 | RM2.1.1 27.01,8.04 | RM1.1.2 27.01,8.04 | 27.01,8.04 v27.24,7.8
  Top 0.3: 21.59,2.07 22.07,2.07 23.6,3.6 28.12,3.6 29.1,4.57 30.78,4.57 31.29,5.08 34.72,5.08 35.94,6.3 38.54,6.3 40.84,8.6 45.04,8.6
  Top 1.016: JP3.1 21.59,2.07
  Bottom 0.2: v27.24,7.8 26.04,9 24.04,9 21.84,6.8 21.84,2.31 JP3.1
PIN2/LCD_D01  (via drill 0.4)
  Top 0.2: U2.3 49.44,12.14 45.3,8 45.24,8 | 26.14,9.41 26.14,9.33 | v26.24,7.6 26.12,7.47 RM2.2.1 RM1.2.2
  Top 0.3: 24.73,2.66 25.13,3.06 28.41,3.06 29.41,4.06 31.04,4.06 31.54,4.57 35.02,4.57 35.68,5.23 35.68,5.24 36.24,5.8 38.84,5.8 41.04,8 45.24,8 | 26.14,9.33 RM1.2.2
  Top 1.016: JP3.2 24.73,2.66
  Bottom 0.2: 23.64,1.58 23.64,4 22.24,5.4 22.24,6.6 24.04,8.4 25.44,8.4 v26.24,7.6
  Bottom 1.016: 23.64,1.58 23.64,1.57 JP3.2
PIN3/LCD_D02  (via drill 0.4)
  Top 0.2: U2.4 49.84,11.9 45.34,7.4 45.24,7.4 | RM1.3.2 RM2.3.1 25.36,7.49 25.24,7.6 v24.64,7.6
  Top 0.3: 26.66,2.06 27.15,2.55 28.69,2.55 29.7,3.56 31.29,3.56 31.8,4.06 35.31,4.06 36.44,5.2 39.04,5.2 41.24,7.4 45.24,7.4
  Top 1.016: 26.66,2.06 26.66,2.05 JP3.3
  Bottom 0.2: 25.44,1.7 25.44,2.8 22.64,5.6 22.64,6.4 23.64,7.4 24.44,7.4 v24.64,7.6
  Bottom 1.016: 25.44,1.7 25.51,1.7 JP3.3
PIN4/LCD_D03  (via drill 0.4)
  Top 0.2: U2.5 50.24,11.67 45.37,6.8 45.24,6.8 | RM2.4.1 23.67,6.22 v23.44,6 23.24,6.2 23.24,7.4 24.47,8.62 RM1.4.2
  Top 0.3: 30.07,2.65 30.47,3.05 31.55,3.05 32.05,3.56 35.53,3.56 36.67,4.7 39.34,4.7 41.44,6.8 45.24,6.8
  Top 1: 28.69,1.27 30.07,2.65
  Top 1.016: 28.69,1.27 28.48,1.27 JP3.4
  Bottom 0.2: v23.44,6 23.44,5.8 26.24,3 26.75,3 JP3.4
PIN5/LCD_D04
  Top 0.2: 45.24,6.2 45.44,6.2 50.64,11.4 U2.6
  Top 0.3: 31.63,1.95 32.73,3.05 35.78,3.05 36.92,4.19 39.59,4.19 41.6,6.2 45.24,6.2
  Top 1.016: 31.63,1.95 31.63,1.94 JP3.5
PIN6/LCD_D05
  Top 0.2: U2.7 51.04,11.2 45.44,5.6 45.24,5.6
  Top 0.3: 34.36,2.14 34.77,2.55 36.04,2.55 37.18,3.68 39.84,3.68 41.76,5.6 45.24,5.6
  Top 1.016: 34.36,2.14 34.36,2.13 JP3.6
PIN7/LCD_D06
  Top 0.2: U2.8 51.44,11 45.44,5 45.24,5
  Top 0.3: 37.54,2.77 37.94,3.18 40.2,3.18 42.02,5 45.24,5
  Top 1.016: 37.54,2.77 JP3.7
PIN8/LCD_D07
  Top 0.2: U2.9 51.84,10.8 45.44,4.4
  Top 0.3: 39.57,2.27 39.8,2.5 40.39,2.5 42.28,4.4 45.44,4.4
  Top 1.016: 39.57,2.27 39.57,2.26 JP3.8
PIN9/LCD_D08/SSP2_MISO
  Top 0.2: 44.74,3.7 52.82,3.7 56.64,7.52 56.64,11.3 57.04,11.7 U2.22
  Top 0.3: 43.14,3.3 43.54,3.7 44.74,3.7
  Top 1.016: 43.14,3.3 43.14,3.29 JP3.9
  Bottom 0.2: 36.03,40.31 37.04,39.3 37.04,14.6 37.54,14.1 37.54,13.2 36.94,12.6 | JP3.9
  Bottom 0.254: 36.94,12.6 36.94,6.9 41.14,2.7 JP3.9
  Bottom 0.305: U$1.8 35.69,13.65 36.34,13 36.54,13 36.94,12.6
  Bottom 1: 36.03,40.31 JP4.4
PIN10/LCD_D09
  Top 0.2: U2.23 57.44,11.5 57.04,11.1 57.04,7.27 53.07,3.3 45.54,3.3 45.54,3.26 45.18,2.9
  Top 0.3: 45.18,2.8 45.18,2.9
  Top 1.016: 45.18,2.8 45.18,2.79 JP3.10
PIN11/LCD_D10
  Top 0.2: 48.94,2.8 49.04,2.9 53.32,2.9 57.44,7.02 57.44,10.9 57.84,11.3 U2.24
  Top 0.4: 47.32,2.4 47.72,2.8 48.94,2.8
  Top 1.016: 47.32,2.4 47.32,2.39 JP3.11
PIN12  (via drill 0.4)
  Top 0.2: U2.10 52.24,10.6 48.44,6.8 v48.44,4.8
  Bottom 0.2: v48.44,4.8 48.64,4.6 48.64,3
  Bottom 1.016: 48.64,3 48.64,1.36 48.71,1.36 JP3.12
PIN13/LCD_D12  (via drill 0.4)
  Top 0.2: v55.84,3.2 55.84,4.2 58.24,6.6 58.24,9 59.24,10 59.24,11.2 59.04,11.4 U2.27
  Top 0.254: v38.44,11.6 38.14,11.3 33.94,11.3 v33.64,11.6
  Bottom 0.2: v55.84,3.2 51.4,3.2
  Bottom 0.254: 51.31,3.13 48.84,5.6 40.64,5.6 38.04,8.2 38.04,11.2 v38.44,11.6 | v33.64,11.6 33.64,12 33.24,12.4 33.24,14.05 U$1.6 | 51.4,3.2 51.38,3.2 51.31,3.13 | 51.31,3.13 JP3.13
  Bottom 1.016: JP3.13 51.24,1.37 51.24,3
PIN14/LCD_D13
  Top 0.2: U2.26 58.64,11.2 58.84,11 58.84,10.2 57.84,9.2 57.84,6.8 53.84,2.8 53.84,2.1 53.81,2.07
  Top 1.016: 53.81,2.07 53.81,1.34 JP3.14
PIN15/LCD_D14  (via drill 0.4)
  Top 0.2: v59.64,3.2 59.04,3.8 59.04,8.6 60.04,9.6 60.04,11.6 59.84,11.8 U2.29
  Bottom 0.2: v59.64,3.2 58.28,3.2 57.18,2.1
  Bottom 1.016: 57.18,2.1 57.18,2.09 JP3.15
PIN16/LCD_D15
  Top 0.2: U2.28 59.44,11.6 59.64,11.4 59.64,9.8 58.64,8.8 58.64,6.4 58.34,6.11 58.34,2.4
  Top 1: 58.34,1.82 58.34,2.4
  Top 1.016: 58.34,1.82 58.41,1.82 JP3.16
PIN17/LCD_D16  (via drill 0.4)
  Top 0.2: U2.19 55.84,12.3 55.44,11.9 55.44,8.2 52.64,5.4 51.49,5.4 50.89,4.8 v50.89,4.75
  Bottom 0.2: 60.89,3.75 60.64,4 51.44,4 50.89,4.55 v50.89,4.75
  Bottom 0.3: 60.89,3.75 61.43,3.21 61.43,2.61
  Bottom 1.016: 61.43,2.61 61.43,1.34 JP3.17
PIN18/LCD_D17/USB_EN  (via drill 0.4)
  Top 0.2: U2.20 56.24,12.1 55.84,11.7 55.84,7.97 52.62,4.75 v51.99,4.75
  Bottom 0.2: v51.99,4.75 52.34,4.4 62.44,4.4 63.97,2.87
  Bottom 1.016: 63.97,2.87 63.97,1.34 JP3.18
PIN19/LCD_DOTCLK  (via drill 0.4)
  Top 0.2: v50.24,5.8 52.44,5.8 55.04,8.4 U2.17
  Bottom 0.2: 66.51,2.73 64.44,4.8 54.24,4.8 53.24,5.8 v50.24,5.8
  Bottom 1.016: 66.51,2.73 66.51,1.34 JP3.19
PIN20/LCD_VSYNC  (via drill 0.4)
  Top 0.2: v50.97,6.65 51.42,6.2 52.24,6.2 54.64,8.6 U2.16
  Bottom 0.2: 69.05,2.49 66.34,5.2 54.44,5.2 53.44,6.2 51.42,6.2 v50.97,6.65
  Bottom 1.016: 69.05,2.49 69.05,1.34 JP3.20
PIN23/LCD_DISP  (via drill 0.4)
  Top 0.2: U2.12 53.04,10.2 51.79,8.95 v51.79,8.45
  Bottom 0.2: v51.79,8.45 52.24,8 53.62,8 55.22,6.4 69.94,6.4 73.74,2.6 75.74,2.6 76.17,2.17
  Bottom 1: 76.17,2.17 76.67,1.67
  Bottom 1.016: 76.67,1.67 76.67,1.34 JP3.23
PIN24/LCD_WR  (via drill 0.4)
  Top 0.2: U2.13 53.44,10.03 52.64,9.22 v52.64,8.8
  Bottom 0.2: 78.34,2.5 77.74,3.1 73.84,3.1 70.14,6.8 55.49,6.8 53.89,8.4 53.04,8.4 v52.64,8.8
  Bottom 1: 78.34,2.5 79.21,1.63
  Bottom 1.016: 79.21,1.63 79.21,1.34 JP3.24
PIN25/LCD_RS  (via drill 0.4)
  Top 0.2: v53.59,9.25 53.59,9.55 53.84,9.8 U2.14
  Top 0.406: R2.2 70.73,9.31 v70.64,9.4
  Bottom 0.2: v53.59,9.25 53.69,9.25 55.74,7.2 70.44,7.2 | 70.44,7.2 74.14,3.5 79.24,3.5 80.64,2.1 80.92,2.1 | v70.64,9.4 70.64,7.4 70.44,7.2
  Bottom 1.016: 80.92,2.1 80.99,2.1 JP3.25
PIN27/PWM2  (via drill 0.4)
  Top 0.2: U2.91 50.64,31.2 56.44,37 65.64,37 v65.99,37.35
  Bottom 0.2: 82.98,40.6 82.94,40.6 77.94,35.6 73.04,35.6 71.04,37.6 66.24,37.6 v65.99,37.35
  Bottom 1: 82.98,40.6 JP4.23
PIN28/SOFT_SDA  (via drill 0.4)
  Top 0.2: U2.31 60.64,12.4 60.84,12.2 61.04,12.2 61.84,11.4 61.84,9.8 62.44,9.2 63.44,9.2 v63.84,8.8 | v79.44,27 79.44,27.4 78.84,28 78.84,39 80.24,40.4 80.34,40.4
  Top 1: 80.34,40.4 81.75,41.81 JP4.22
  Bottom 0.2: v63.84,8.8 66.04,8.8 70.24,13 70.24,14 70.84,14.6 70.84,15 75.04,19.2 75.04,23.6 77.64,26.2 78.64,26.2 v79.44,27
PIN29/SOFT_SCL  (via drill 0.4)
  Top 0.2: v76.64,37.6 77.44,36.8 77.44,26 75.84,24.4 75.84,16.6 v74.04,14.8 | U2.34 69.84,15.2 v71.44,13.6
  Bottom 0.2: v76.64,37.6 79.21,40.17 79.21,40.37 | v71.44,13.6 72.64,14.8 v74.04,14.8
  Bottom 1: 79.21,40.37 JP4.21
PIN30  (via drill 0.4)
  Top 0.2: U2.81 54.64,29.7 55.24,30.3 55.24,31.6 57.84,34.2 62.44,34.2 63.04,33.6 64.04,33.6 64.64,34.2 v64.64,34.3
  Bottom 0.2: 73.56,38.8 65.04,38.8 64.34,38.1 64.34,34.7 64.64,34.4 v64.64,34.3
  Bottom 1: 73.56,38.8 JP4.20
PIN31  (via drill 0.4)
  Top 0.2: U2.82 54.24,29.9 54.84,30.5 54.84,31.8 57.64,34.6 63.24,34.6 63.44,34.4 63.54,34.4 v63.64,34.3
  Bottom 0.2: 72.02,39.8 71.42,39.2 64.84,39.2 63.64,38 v63.64,34.3
  Bottom 1: 72.02,39.8 JP4.19
PIN32/LRADC1  (via drill 0.4)
  Top 0.2: U2.107 48.27,23.2 48.79,22.68 v48.79,22.62
  Bottom 0.2: v48.79,22.62 48.12,23.3 47.24,23.3 44.84,25.7 44.14,25.7 43.84,26 43.84,28.2 53.04,37.4 62.44,37.4 64.64,39.6 69.28,39.6 69.78,40.1
  Bottom 1: 69.78,40.1 JP4.18
PIN33/LRADC0  (via drill 0.4)
  Top 0.2: U2.108 48.04,22.8 48.14,22.7 48.14,22.15 v48.54,21.75
  Bottom 0.2: v48.54,21.75 48.19,21.75 44.64,25.3 43.94,25.3 43.44,25.8 43.44,28.4 52.84,37.8 62.24,37.8 64.44,40 67.14,40 67.64,40.5
  Bottom 1: 67.64,40.5 JP4.17
PIN34/MIC  (via drill 0.4)
  Top 0.2: U2.116 48.54,19.6 49.39,20.45 v49.39,21.3
  Bottom 0.2: v49.39,21.3 49.14,21.05 48.29,21.05 44.44,24.9 43.74,24.9 43.04,25.6 43.04,28.6 52.64,38.2 62.04,38.2 64.24,40.4 65,40.4 65.4,40.8
  Bottom 1: 65.4,40.8 JP4.16
PWM0/DUART_RXD  (via drill 0.4)
  Top 0.2: U2.125 45.34,16 44.94,15.6 38.94,15.6 v38.4,15.06 | R8.2 45.74,36.3 v45.24,36.8
  Bottom 0.2: v38.4,15.06 38.4,15.16 38.24,15.32 38.24,32.4 42.64,36.8 v45.24,36.8 45.24,41 45.84,41.6 45.84,41.56 | 45.14,40.86 45.24,40.96
  Bottom 1: 45.24,40.96 45.84,41.56 JP4.8
PWM1/DUART_TXD  (via drill 0.4)
  Top 0.2: U2.126 45.54,15.6 45.14,15.2 39.87,15.2 v39.62,14.95
  Bottom 0.2: v39.62,14.95 39.62,15.14 38.64,16.12 38.64,32.2 42.44,36 45.64,36 46.84,37.2 46.84,40 47.64,40.8 47.64,40.9
  Bottom 1: 47.64,40.9 48.65,41.91 JP4.9
RASN  (via drill 0.4)
  Top 0.2: U2.62 63.67,26.4 63.87,26.6 65.44,26.6 65.84,26.2 v66.64,26.2
  Bottom 0.2: U1.23 50.94,16 54.04,19.1 56.64,19.1 58.44,20.9 64.04,20.9 66.34,23.2 66.34,25.9 v66.64,26.2
SD_VCC  (via drill 0.4)
  Top 0.2: v75.44,31.6 75.84,32 75.84,35.6 73.53,37.92 L2.2
  Top 0.4: C36.2 C37.2 71.36,38.4 L2.2
  Top 0.406: SD.4 82.79,31.55 v81.94,30.7
  Bottom 0.2: v75.44,31.6 76.34,30.7 v81.94,30.7
SSP1_CMD  (via drill 0.4)
  Top 0.2: U2.83 53.84,30.4 v54.14,30.7 | v60.64,33 65.64,33 67.64,31 69.04,31 69.64,30.4 v69.84,30.4 69.84,29.39 R7.1
  Top 0.406: SD.3 82.5,32.65 v81.94,32.1
  Bottom 0.2: v81.94,32.1 81.74,32.1 81.24,32.6 75.24,32.6 73.04,30.4 v69.84,30.4 | v54.14,30.7 54.14,31.1 56.44,33.4 60.24,33.4 v60.64,33
SSP1_DATA0  (via drill 0.4)
  Top 0.2: U2.84 53.44,31 57.44,35 64.84,35 66.84,33 66.84,32.6 67.34,32.1 v68.14,32.1 68.64,31.6 69.97,31.6 RM3.4.1
  Top 0.406: SD.7 82.89,28.25 v82.04,29.1
  Bottom 0.2: v68.14,32.1 68.34,31.9 68.34,30.3 69.44,29.2 81.94,29.2 v82.04,29.1
SSP1_DATA1  (via drill 0.4)
  Top 0.2: U2.85 53.04,31.2 57.24,35.4 65.04,35.4 67.49,32.95 v67.54,32.95 68.51,32.95 69.05,32.41 RM3.3.1
  Top 0.406: SD.8 82.79,27.15 v82.04,27.9
  Bottom 0.2: v67.54,32.95 67.34,32.75 67.34,31.95 67.94,31.35 67.94,30.1 69.24,28.8 81.14,28.8 v82.04,27.9
SSP1_DATA2  (via drill 0.4)
  Top 0.2: U2.86 52.64,31.4 57.04,35.8 65.24,35.8 67.44,33.6 69.04,33.6 69.64,34.2 69.94,34.2 | RM3.1.1 69.98,34.06 69.94,34.1 69.94,34.2 | 69.94,34.2 v69.94,35.5
  Top 0.406: SD.1 82.9,34.85 v82.84,34.8
  Bottom 0.2: v69.94,35.5 69.94,35.1 70.74,34.3 82.44,34.3 82.84,34.7 v82.84,34.8
SSP1_DATA3  (via drill 0.4)
  Top 0.2: U2.87 52.24,31.6 56.84,36.2 65.44,36.2 67.44,34.2 68.54,34.2 v68.64,34.3 | R6.1 73.64,24.6 75.84,26.8 75.84,29.4 73.64,31.6 v73.04,31.6
  Top 0.406: SD.2 82.19,33.75 v82.04,33.6
  Bottom 0.2: v68.64,34.3 69.34,33.6 73.04,33.6 | 73.04,33.6 v82.04,33.6 | v73.04,31.6 73.04,33.6
SSP1_SCK  (via drill 0.4)
  Top 0.2: U2.90 51.04,31 56.64,36.6 65.64,36.6 67.39,34.85 v67.74,34.85
  Top 0.406: SD.5 83.19,30.45 v83.04,30.3
  Bottom 0.2: v67.74,34.85 67.74,33.8 68.84,32.7 68.84,30.4 69.63,29.62 81.16,29.62 81.44,29.9 82.34,29.9 82.74,30.3 | v83.04,30.3 82.74,30.3 | 82.73,30.3 82.74,30.3
SSP2_MOSI  (via drill 0.4)
  Top 0.2: v46.74,4.4 47.04,4.1 52.59,4.1 56.24,7.75 56.24,11.5 56.64,11.9 U2.21
  Top 0.254: v35.24,7 37.64,7 v37.84,7.2
  Bottom 0.2: v46.74,4.4 40.24,4.4 37.84,6.8 v37.84,7.2 37.44,7.6 37.44,12.2 38.04,12.8 38.04,14.2 37.44,14.8 37.44,39.2 38.57,40.33
  Bottom 0.254: U$1.15 28.07,5.92 29.14,7 v35.24,7
  Bottom 1: 38.57,40.33 JP4.5
SSP2_SCK  (via drill 0.4)
  Top 0.2: v78.24,27 78.24,37.2 75.04,40.4 43.14,40.4 41.63,41.91 | U2.33 68.04,14.8 v69.44,13.4 | 34.44,8.9 35.14,9.6 v40.64,9.6
  Top 0.254: v34.44,7.7 34.44,8.9
  Top 1: 41.63,41.91 JP4.6
  Bottom 0.2: v78.24,27 77.84,27 74.64,23.8 74.64,19.4 70.44,15.2 70.44,14.8 69.44,13.8 v69.44,13.4 69.44,12.8 66.04,9.4 65.04,9.4 64.84,9.6 63.64,9.6 62.84,8.8 57.44,8.8 55.04,11.2 42.24,11.2 v40.64,9.6
  Bottom 0.254: U$1.16 26.8,5.65 28.74,7.6 34.34,7.6 v34.44,7.7
USB_DM  (via drill 0.4)
  Top 0.2: U2.123 44.84,16.8 44.44,16.4 35.24,16.4 v35.04,16.2
  Bottom 0.2: JP1.1 22.41,15.37 22.84,15.8 34.64,15.8 v35.04,16.2
USB_DP  (via drill 0.4)
  Top 0.2: U2.124 45.04,16.4 44.64,16 36.24,16 v35.84,15.6
  Bottom 0.2: JP1.2 20.94,13.2 23.14,15.4 35.64,15.4 v35.84,15.6
V+  (via drill 0.4)
  Top 0.2: U2.38 63.64,16.8 64.04,16.4 65.16,16.4 C16.2 | U2.53 63.54,22.8 64.54,21.8 65.34,21.8 C7.2 | 47.14,23.6 U2.106 44.42,23.6 v44.02,23.2 | C19.2 63.26,12.8 65.64,12.8 65.84,13 66.84,13 v67.04,12.8 | 65.84,16.91 C16.2 | 65.84,17.09 C16.2 | U2.45 64.95,19.6 C6.2
  Top 0.3: v63.34,30.15 63.89,30.15 65.24,28.8 67.04,28.8 69.44,26.4 69.84,26.4 70.24,26 70.24,25.09 C24.1 R3.2
  Top 0.4: C8.2 43.47,23.75 v44.02,23.2 | 39.54,19.6 C17.2 39.54,19.42 | C20.2 59.95,8.71 60.74,9.5 v60.74,10.6 | C19.2 63.04,13 v62.04,13 | R3.2 66.04,22.8 65.88,22.96 | 59.55,32.89 60.64,31.8 v60.64,31.4
  Top 0.406: C21.2 59.44,33 59.55,32.89
  Top 0.5: C7.2 C6.2 65.36,19.69 66.64,18.4 v66.64,18.5 65.84,17.7 65.84,17.09 | C18.2 68.73,19.51 v68.44,19.8 | 65.34,21.8 65.34,22.42 65.88,22.96 66.24,23.32 66.24,23.99 R1.2 | C5.2 69.53,16.11 v68.84,16.8 | v41.64,18.2 40.44,18.2 39.64,19 39.64,19.46 C17.2
  Bottom 0.2: 61.99,27.55 61.84,27.7 61.84,28.5 62.64,29.3 62.64,29.8 62.24,30.2 60.64,30.2 | U1.3 63.94,14.3 64.24,14 65.64,14 66.44,14.8 66.44,16.6 66.64,16.8 | 58.34,11.5 59.84,10 61.24,10 62.24,11 66.44,11 67.84,12.4 67.84,13.4 69.44,15 69.44,16.2 v68.84,16.8 | 54.19,13.9 54.19,13.85 | v67.04,12.8 67.04,12.2 66.24,11.4 61.64,11.4 60.84,10.6 v60.74,10.6 | v44.02,23.2 45.34,21.88 45.34,20.6 45.14,20.4 45.14,19.5 44.84,19.2 43.84,19.2 | 43.84,19.2 43.74,19.2 43.74,19.1 43.94,19.1 43.84,19.2 | 66.84,19.8 65.84,18.8 65.84,16.4 65.24,15.8 U1.1
  Bottom 0.4: 61.99,27.55 U1.61 | U1.33 44.44,19.1 43.94,19.1 | 58.34,11.5 56.54,11.5 54.19,13.85 | U1.18 54.19,13.9 44.04,13.9 43.74,14.2 43.74,19.1 | v41.64,18.2 42.64,19.2 43.74,19.2 | U1.55 58.09,27.85 60.44,30.2 | v60.74,10.6 60.24,10.6 57.24,13.6 56.64,13.6 56.14,14.1 U1.15 | v62.04,13 61.04,13 60.04,14 U1.9
  Bottom 0.406: 60.44,30.2 60.64,30.2 60.64,30.8
  Bottom 0.5: v63.34,30.15 63.34,30.21 62.76,30.8 60.64,30.8 v60.64,31.4 | v67.04,12.8 67.04,13.4 68.84,15.2 v68.84,16.8 66.64,16.8 v66.64,18.5 66.74,18.5 68.04,19.8 | 66.84,19.8 68.04,19.8 | 68.04,19.8 v68.44,19.8
VCC  (via drill 0.4)
  Top 0.2: U2.92 50.24,31.4 53.84,35 C4.2 | 55.64,14.5 55.44,14.3 U2.18 | U2.95 49.04,31.2 v48.64,31.6 | R11.2 67.04,8.11 | R8.1 48.83,36.21 49.64,35.4 49.64,33.2 49.44,33 48.73,33 C15.2 | R10.2 68.84,8.09 R2.1
  Top 0.254: R9.2 67.24,8.2 67.24,8.11
  Top 0.4: v48.64,31.6 C15.2 C14.2 | 68.95,9.51 R2.1 68.87,8.11 67.24,8.11 67.04,8.11 | D2.2 D3.2 D01_.2 D4.2 29.26,13.38 29.84,12.8 v29.84,11.8 | RM3.3.2 72.45,32.41 72.64,32.6 72.64,33.8 72.44,34 71.63,34 RM3.1.2 71.84,34.33 L2.1 72.53,35.88 v73.44,36.8
  Top 0.406: v35.64,8.9 39.74,8.9 v39.84,8.8 | 68.95,9.51 68.93,9.51 v68.84,9.6
  Top 0.5: 55.64,14.5 61.34,14.5 61.74,14.1 64.84,14.1 | 68.84,12.4 71.64,12.4 72.44,13.2 72.44,25.2 72.64,25.4 72.64,30.4 71.64,30.4 | 64.84,14.1 67.14,14.1 68.84,12.4 | v65.04,37.7 64.89,37.85 56.29,37.85 v54.94,36.5 54.76,36.31 C4.2 | RM3.3.2 RM3.4.2 71.57,30.47 71.64,30.4 | C3.2 64.84,14.1 | v68.84,9.6 68.84,12.4 | R7.2 71.53,30.29 71.64,30.4
  Bottom 0.4: 28.24,14 28.07,14 U$1.2 | v29.84,11.8 28.64,10.6
  Bottom 0.406: 28.24,14 28.24,11 28.64,10.6 29.34,9.9 34.74,9.9 35.64,9 v35.64,8.9
  Bottom 0.5: v54.94,36.5 54.94,36.3 50.24,31.6 v48.64,31.6 | v65.04,37.7 65.54,38.2 72.04,38.2 v73.44,36.8 | v68.84,9.6 67.04,7.8 57.04,7.8 54.64,10.2 42.64,10.2 41.24,8.8 v39.84,8.8
VDD4P2
  Top 0.2: U2.101 38.04,25.6 35.84,27.8 35.84,29.05 D1.K 34.96,30
  Top 0.203: 34.94,30 34.96,30
  Top 0.5: C10.2 C9.2 34.81,30.09 D1.K
VDDXTAL  (via drill 0.4)
  Top 0.2: v42.74,18.05 42.99,17.8 43.99,17.8 44.19,18 | 44.19,18 U2.120 | U2.119 44.59,18.4 44.19,18
  Top 0.4: 42.44,12.8 v42.84,13.2
  Top 0.406: C31.2 42.04,12.4 42.44,12.8
  Bottom 0.4: v42.84,13.2 42.84,17.95 v42.74,18.05
WEN  (via drill 0.4)
  Top 0.2: U2.77 56.24,27 55.04,25.8 55.04,25.5 52.54,23 52.54,20.2 54.74,18 v55.14,18
  Bottom 0.2: U1.21 52.24,16.1 54.14,18 v55.14,18
XTALI
  Top 0.2: U2.122 44.64,17.2 44.24,16.8 36.64,16.8 Y1.1 | C32.2
  Top 0.3: Y1.1 C32.2
XTALO
  Top 0.2: U2.121 44.44,17.6 44.04,17.2 40.24,17.2 39.24,18.2 38.34,19.1 38.34,19.5 Y1.2 37.65,19.59
  Top 0.3: 37.65,19.59 37.65,21.28
  Top 0.4: 37.65,21.28 C33.2

## Text on the board
tPlace: 4 | 3 | 2 | 1
bNames: 5 | 6 | 7 | 8 | 9 | 10 | 11 | 12 | 13 | 14 | 15 | 16 | 17 | 18 | 19 | 20 | 21 | 22 | 23 | 24 | 25 | 26 | 27 | 28 | GND | BAT | WB-IMX233-CORE rev. C3 | 3 | 4 | 5 | 6 | 7 | 8 | 9 | 10 | 11 | 12 | 13 | 14 | 15 | 16 | 17 | 18 | 19 | 20 | 21 | 22 | 23 | 24 | 25 | 26 | 27
Nadnisi: WB-IMX233-CORE | rev. C3